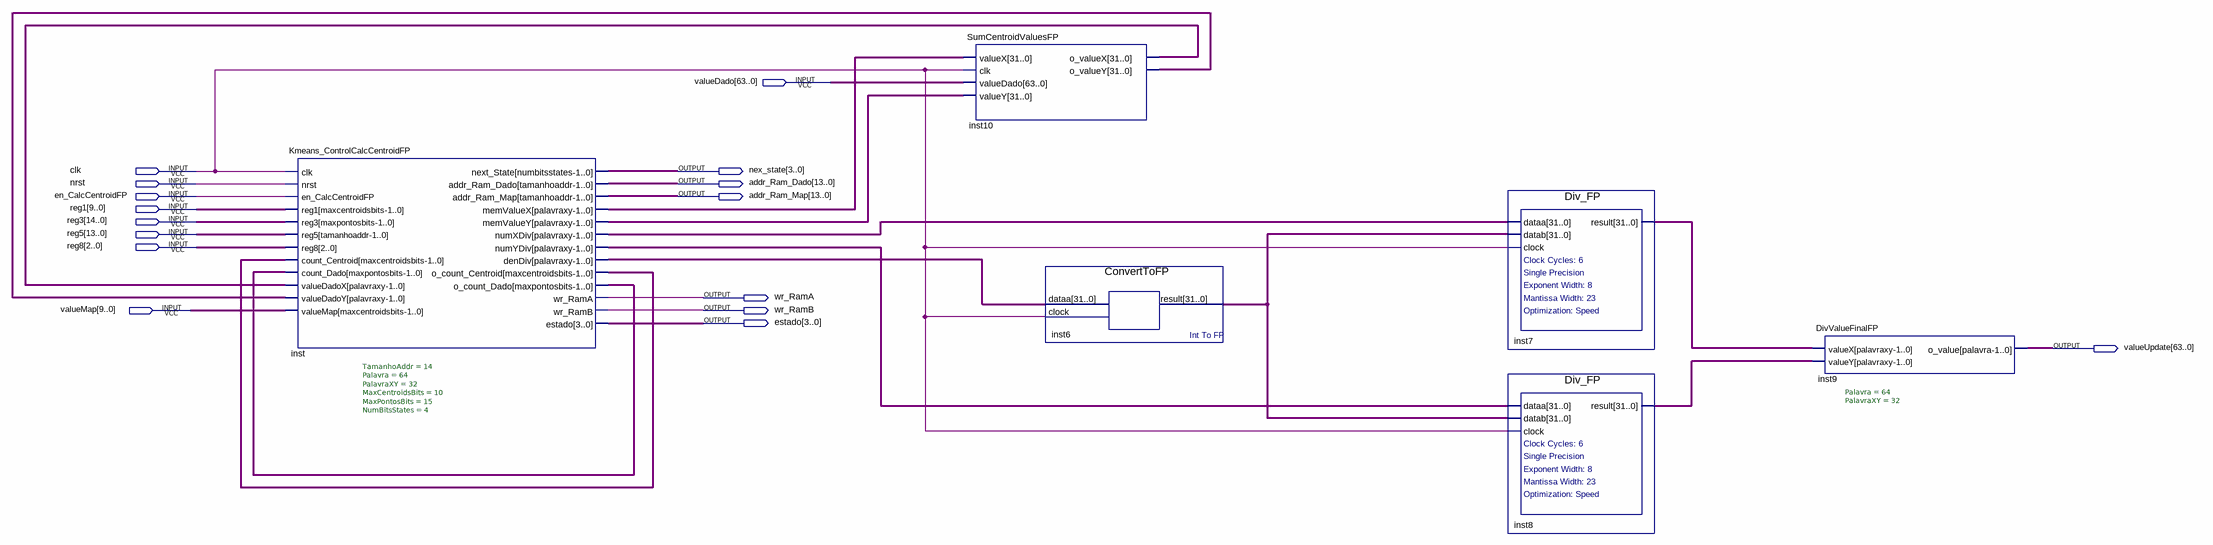
[diagram p0: schematic sheet]
// Quartus schematic Kmeans_CalcCentroidModuleFP.bdf as structural Verilog: 6 symbols, 16 pins
module Kmeans_CalcCentroidModuleFP (
  input  [63:0] valueDado,
  input  clk,
  input  nrst,
  input  en_CalcCentroidFP,
  input  [9:0] reg1,
  input  [14:0] reg3,
  input  [13:0] reg5,
  input  [2:0] reg8,
  input  [9:0] valueMap,
  output [3:0] nex_state,
  output [13:0] addr_Ram_Dado,
  output [13:0] addr_Ram_Map,
  output wr_RamA,
  output wr_RamB,
  output [3:0] estado,
  output [63:0] valueUpdate
);

  wire [9:0] inst_o_count_centroid;
  wire [14:0] inst_o_count_dado;
  wire [31:0] inst6_result, inst7_result, inst8_result, inst10_o_valuex, inst10_o_valuey, inst_dendiv,
       inst_memvaluex, inst_memvaluey, inst_numxdiv, inst_numydiv;

  Kmeans_ControlCalcCentroidFP #(.TamanhoAddr(14), .Palavra(64), .PalavraXY(32), .MaxCentroidsBits(10), .MaxPontosBits(15), .NumBitsStates(4)) inst (
    .clk(clk), .nrst(nrst), .en_CalcCentroidFP(en_CalcCentroidFP), .reg1(reg1), .reg3(reg3), .reg5(reg5),
    .reg8(reg8), .count_Centroid(inst_o_count_centroid), .count_Dado(inst_o_count_dado),
    .valueDadoX(inst10_o_valuex), .valueDadoY(inst10_o_valuey), .valueMap(valueMap), .next_State(nex_state),
    .addr_Ram_Dado(addr_Ram_Dado), .addr_Ram_Map(addr_Ram_Map), .memValueX(inst_memvaluex),
    .memValueY(inst_memvaluey), .numXDiv(inst_numxdiv), .numYDiv(inst_numydiv), .denDiv(inst_dendiv),
    .o_count_Centroid(inst_o_count_centroid), .o_count_Dado(inst_o_count_dado), .wr_RamA(wr_RamA),
    .wr_RamB(wr_RamB), .estado(estado));
  SumCentroidValuesFP inst10 (
    .valueX(inst_memvaluex), .clk(clk), .valueDado(valueDado), .valueY(inst_memvaluey),
    .o_valueX(inst10_o_valuex), .o_valueY(inst10_o_valuey));
  ConvertToFP inst6 (.dataa(inst_dendiv), .clock(clk), .result(inst6_result));
  Div_FP inst7 (.dataa(inst_numxdiv), .datab(inst6_result), .clock(clk), .result(inst7_result));
  Div_FP inst8 (.dataa(inst_numydiv), .datab(inst6_result), .clock(clk), .result(inst8_result));
  DivValueFinalFP #(.Palavra(64), .PalavraXY(32)) inst9 (
    .valueX(inst7_result), .valueY(inst8_result), .o_value(valueUpdate));
endmodule
